# EAGLE design proud (EAGLE 9.3.0)
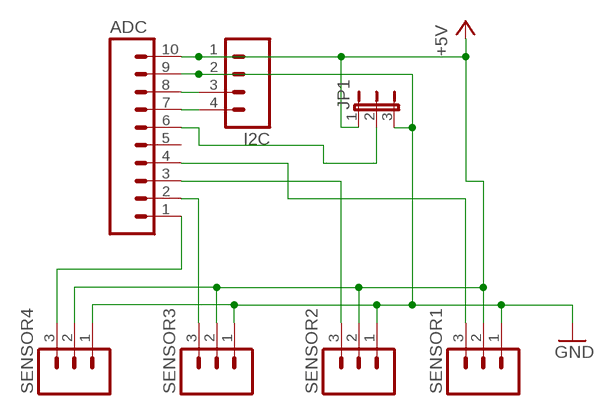
[diagram p0: schematic, sheet 1]

## Parts
ADC  M10  [10P]
I2C  M04  [04P]
JP1  JP2E  [JP2]
SENSOR1  M03  [03P]
SENSOR2  M03  [03P]
SENSOR3  M03  [03P]
SENSOR4  M03  [03P]

## Nets
+5V: ADC.10 I2C.1 JP1.1 SENSOR1.2 SENSOR2.2 SENSOR3.2 SENSOR4.2
GND: ADC.9 I2C.2 JP1.3 SENSOR1.1 SENSOR2.1 SENSOR3.1 SENSOR4.1
N$1: ADC.1 SENSOR4.3
N$2: ADC.8 I2C.3
N$5: ADC.2 SENSOR3.3
N$6: ADC.3 SENSOR2.3
N$7: ADC.4 SENSOR1.3
N$11: ADC.7 I2C.4
N$14: ADC.6 JP1.2
Unconnected: ADC.5

## Library data of the parts
ADC = con-amp-quick:M10: AMP QUICK CONNECTOR; OC_FARNELL: unknown; OC_NEWARK: unknown
I2C = con-amp-quick:M04: AMP QUICK CONNECTOR; OC_FARNELL: unknown; OC_NEWARK: unknown
JP1 = jumper:JP2E: JUMPER
SENSOR1-SENSOR4 = con-amp-quick:M03: AMP QUICK CONNECTOR; OC_FARNELL: unknown; OC_NEWARK: unknown

## Board
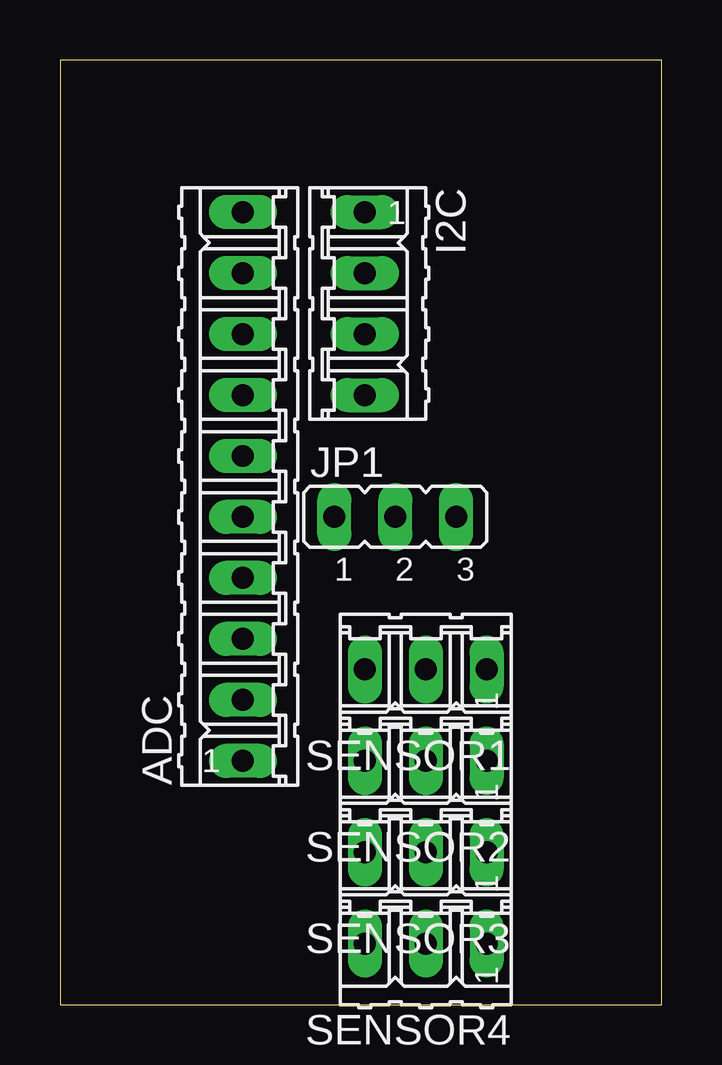
[diagram p1: board, top side]
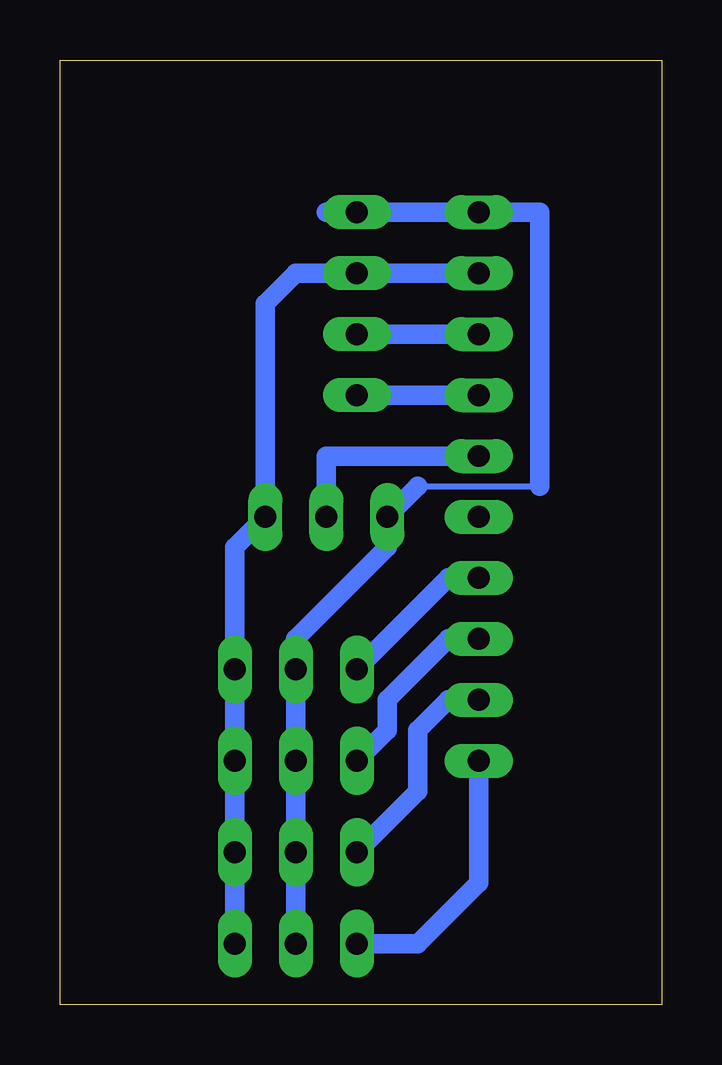
[diagram p2: board, bottom side, seen from below]

Size 25.07 x 39.36 mm. Coordinates in mm from the lower left corner, seen from the top.
Outline: 0,0 25.07,0 25.07,39.36 0,39.36 0,0
Copper layers (1*16): Top 0.035mm / dielectric 1.5mm / Bottom 0.035mm
Design rules "default": minimum track width 6mil, minimum drill 0.35mm, track to track 6mil, track to pad 6mil, pad to pad 6mil, via to via 6mil, smd to smd 6mil, copper to edge 40mil, drill to drill 6mil, minimum pad ring 10mil, minimum via ring 8mil, stop-mask expansion 4mil, vias tented up to drill 0mil, thermal gap 10mil

### Footprints (pad centres in the part's own frame; a part is rotated, then mirrored left to right if it is on the bottom)
10P = drill 0.914 long: 1 -11.43,0; 2 -8.89,0; 3 -6.35,0; 4 -3.81,0; 5 -1.27,0; 6 1.27,0; 7 3.81,0; 8 6.35,0; 9 8.89,0; 10 11.43,0
04P = drill 0.914 long: 1 -3.81,0; 2 -1.27,0; 3 1.27,0; 4 3.81,0
JP2 = drill 0.914 long: 1 -2.54,0; 2 0,0; 3 2.54,0
03P = drill 0.914 long: 1 -2.54,0; 2 0,0; 3 2.54,0

### Placement (x,y rotation side)
ADC  7.62,21.59 90 top
I2C  12.7,29.21 270 top
JP1  13.97,20.32 0 top
SENSOR1  15.24,13.97 180 top
SENSOR2  15.24,10.16 180 top
SENSOR3  15.24,6.35 180 top
SENSOR4  15.24,2.54 180 top

### Tracks (layer width: path | path; a pad name or v marks a point on that pad's centre or on a via)
+5V
  Bottom 0.254: 10.16,21.59 5.08,21.59
  Bottom 0.813: 13.97,33.02 I2C.1 ADC.10 5.08,33.02 5.08,21.59 | 10.16,21.59 JP1.1 11.43,19.05 15.24,15.24 SENSOR1.2 SENSOR2.2 SENSOR3.2 SENSOR4.2
GND
  Bottom 0.813: ADC.9 I2C.2 15.24,30.48 16.51,29.21 JP1.3 17.78,19.05 SENSOR1.1 SENSOR2.1 SENSOR3.1 SENSOR4.1
N$1
  Bottom 0.813: ADC.1 7.62,5.08 10.16,2.54 SENSOR4.3
N$2
  Bottom 0.813: ADC.8 I2C.3
N$5
  Bottom 0.813: ADC.2 8.89,12.7 10.16,11.43 10.16,8.89 SENSOR3.3
N$6
  Bottom 0.813: ADC.3 8.89,15.24 11.43,12.7 11.43,11.43 SENSOR2.3
N$7
  Bottom 0.813: ADC.4 8.89,17.78 SENSOR1.3
N$11
  Bottom 0.813: ADC.7 I2C.4
N$14
  Bottom 0.813: JP1.2 13.97,22.86 ADC.6